# Altium schematic sheet SH3 - MCU.SchDoc
size B
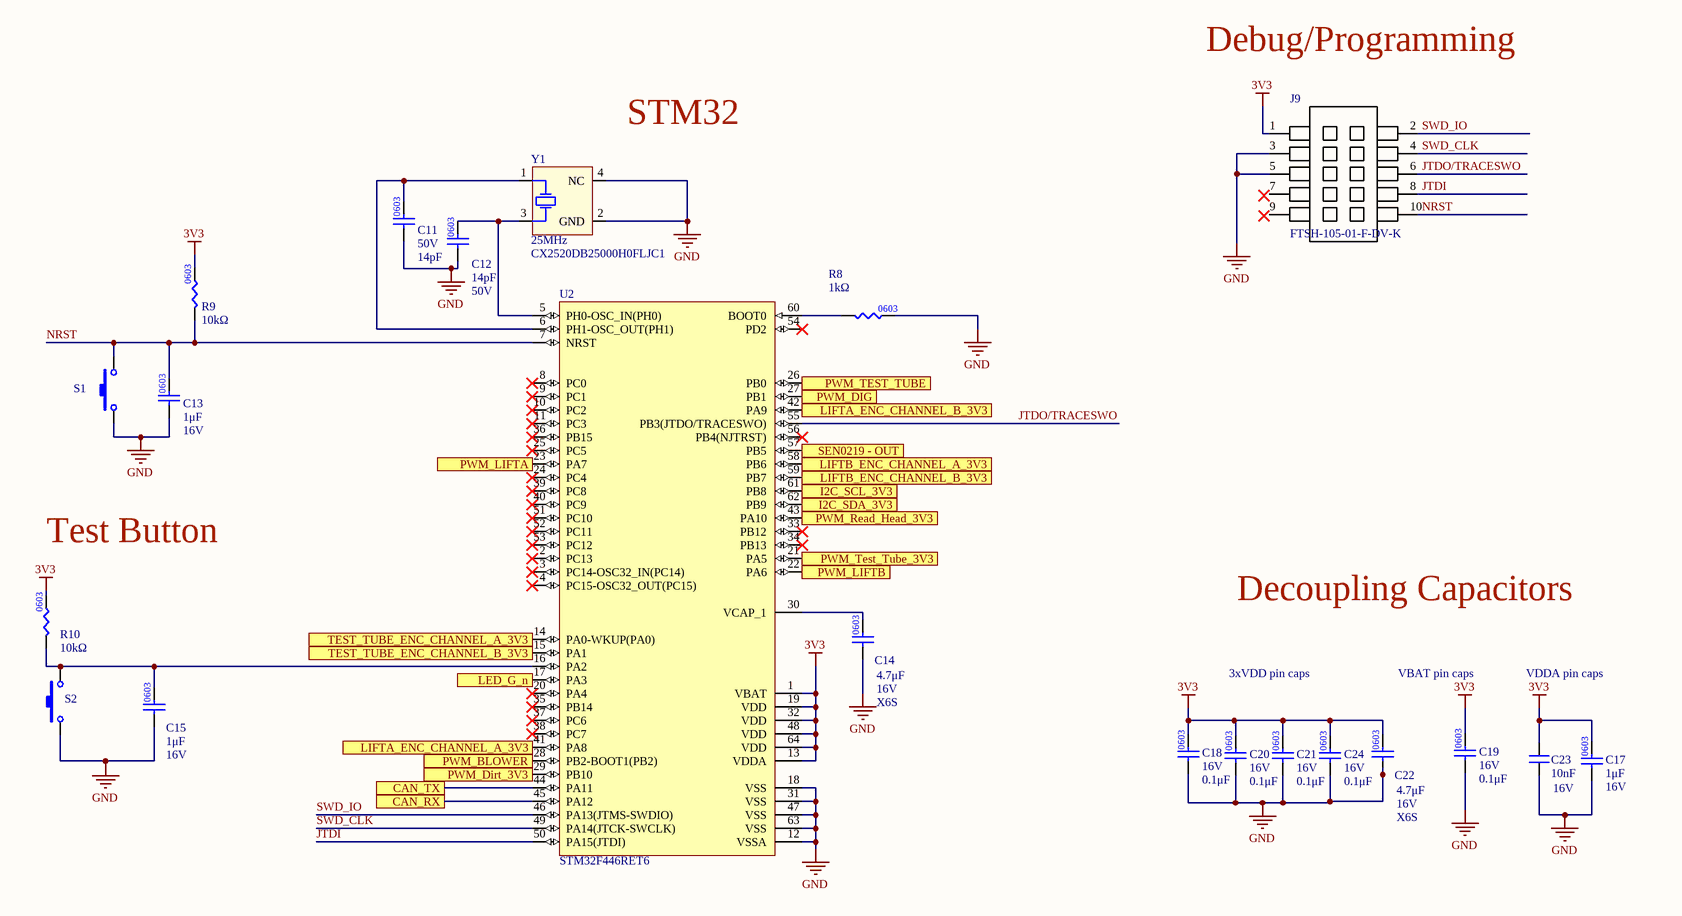
[diagram p0: SH3 - MCU.SchDoc]

## Parts
C11  value 14pF  Voltage Rating: 50V  [CAP0603]  (hidden comment: CAP_14pF_50V_0603)
C12  value 14pF  Voltage Rating: 50V  [CAP0603]  (hidden comment: CAP_14pF_50V_0603)
C13  value 1μF  Voltage Rating: 16V  [CAP0603]  (hidden comment: CAP_1uF_16V_0603)
C14  value 4.7μF  Dielectric: X6S  Voltage Rating: 16V  [CAP0603]  (hidden comment: CAP_4.7uF_16V_0603)
C15  value 1μF  Voltage Rating: 16V  [CAP0603]  (hidden comment: CAP_1uF_16V_0603)
C17  value 1μF  Voltage Rating: 16V  [CAP0603]  (hidden comment: CAP_1uF_16V_0603)
C18  value 0.1μF  Voltage Rating: 16V  [CAP0603]  (hidden comment: CAP_0.1uF_16V_0603)
C19  value 0.1μF  Voltage Rating: 16V  [CAP0603]  (hidden comment: CAP_0.1uF_16V_0603)
C20  value 0.1μF  Voltage Rating: 16V  [CAP0603]  (hidden comment: CAP_0.1uF_16V_0603)
C21  value 0.1μF  Voltage Rating: 16V  [CAP0603]  (hidden comment: CAP_0.1uF_16V_0603)
C22  value 4.7μF  Dielectric: X6S  Voltage Rating: 16V  [CAP0603]  (hidden comment: CAP_4.7uF_16V_0603)
C23  value 10nF  Voltage Rating: 16V  [CAP0603]  (hidden comment: CAP_10nF_0603)
C24  value 0.1μF  Voltage Rating: 16V  [CAP0603]  (hidden comment: CAP_0.1uF_16V_0603)
J9  Manufacturer Part Number 1: FTSH-105-01-F-DV-K  [FTSH-105-01-F-DV-K-P-TR]  (hidden comment: CON_PROGRAMMING)
R8  value 1kΩ  [RES0603]  (hidden comment: RES_1kΩ_0603_5%)
R9  value 10kΩ  [RES0603]  (hidden comment: RES_10kΩ_0603_5%)
R10  value 10kΩ  [RES0603]  (hidden comment: RES_10kΩ_0603_5%)
S1  SW_TACTILE  [B3U-1000P]  (value not drawn)
S2  SW_TACTILE  [B3U-1000P]  (value not drawn)
U2  STM32F446RET6  [STM-LQFP64_L]
Y1  Frequency: 25MHz  Manufacturer Part Number 1: CX2520DB25000H0FLJC1  [SOIC254P1016X440-4N]  (hidden comment: CRYSTAL_25MHZ)

## Ports
CAN_RX, CAN_TX, I2C_SCL_3V3, I2C_SDA_3V3, LED_G_n, LIFTA_ENC_CHANNEL_A_3V3, LIFTA_ENC_CHANNEL_B_3V3, LIFTB_ENC_CHANNEL_A_3V3, LIFTB_ENC_CHANNEL_B_3V3, PWM_BLOWER, PWM_DIG, PWM_Dirt_3V3, PWM_LIFTA, PWM_LIFTB, PWM_Read_Head_3V3, PWM_TEST_TUBE, PWM_Test_Tube_3V3, SEN0219 - OUT, TEST_TUBE_ENC_CHANNEL_A_3V3, TEST_TUBE_ENC_CHANNEL_B_3V3

## Nets
3V3: C17.2 C18.2 C19.2 C20.2 C21.2 C22.2 C23.2 C24.2 J9.1 R9.2 R10.2 U2.1(VBAT) U2.13(VDDA) U2.19(VDD) U2.32(VDD) U2.48(VDD) U2.64(VDD)
GND: C11.1 C12.1 C13.1 C14.1 C15.1 C17.1 C18.1 C19.1 C20.1 C21.1 C22.1 C23.1 C24.1 J9.3 J9.5 R8.2 S1.2 S2.1 U2.12(VSSA) U2.18(VSS) U2.31(VSS) U2.47(VSS) U2.63(VSS) Y1.2(GND) Y1.4(NC)
CAN_RX: U2.45(PA12) ; port CAN_RX
CAN_TX: U2.44(PA11) ; port CAN_TX
I2C_SCL_3V3: U2.61(PB8) ; port I2C_SCL_3V3
I2C_SDA_3V3: U2.62(PB9) ; port I2C_SDA_3V3
JTDI: J9.8 U2.50(PA15(JTDI))
JTDO/TRACESWO: J9.6 U2.55(PB3(JTDO/TRACESWO))
LED_G_n: U2.17(PA3) ; port LED_G_n
LIFTA_ENC_CHANNEL_A_3V3: U2.41(PA8) ; port LIFTA_ENC_CHANNEL_A_3V3
LIFTA_ENC_CHANNEL_B_3V3: U2.42(PA9) ; port LIFTA_ENC_CHANNEL_B_3V3
LIFTB_ENC_CHANNEL_A_3V3: U2.58(PB6) ; port LIFTB_ENC_CHANNEL_A_3V3
LIFTB_ENC_CHANNEL_B_3V3: U2.59(PB7) ; port LIFTB_ENC_CHANNEL_B_3V3
NRST: C13.2 J9.10 R9.1 S1.1 U2.7(NRST)
PWM_BLOWER: U2.28(PB2-BOOT1(PB2)) ; port PWM_BLOWER
PWM_DIG: U2.27(PB1) ; port PWM_DIG
PWM_Dirt_3V3: U2.29(PB10) ; port PWM_Dirt_3V3
PWM_LIFTA: U2.23(PA7) ; port PWM_LIFTA
PWM_LIFTB: U2.22(PA6) ; port PWM_LIFTB
PWM_Read_Head_3V3: U2.43(PA10) ; port PWM_Read_Head_3V3
PWM_TEST_TUBE: U2.26(PB0) ; port PWM_TEST_TUBE
PWM_Test_Tube_3V3: U2.21(PA5) ; port PWM_Test_Tube_3V3
SEN0219 - OUT: U2.57(PB5) ; port SEN0219 - OUT
SWD_CLK: J9.4 U2.49(PA14(JTCK-SWCLK))
SWD_IO: J9.2 U2.46(PA13(JTMS-SWDIO))
TEST_TUBE_ENC_CHANNEL_A_3V3: U2.14(PA0-WKUP(PA0)) ; port TEST_TUBE_ENC_CHANNEL_A_3V3
TEST_TUBE_ENC_CHANNEL_B_3V3: U2.15(PA1) ; port TEST_TUBE_ENC_CHANNEL_B_3V3
NetC11_2: C11.2 U2.6(PH1-OSC_OUT(PH1)) Y1.1(HOT)
NetC12_2: C12.2 U2.5(PH0-OSC_IN(PH0)) Y1.3(HOT)
NetC14_2: C14.2 U2.30(VCAP_1)
NetC15_2: C15.2 R10.1 S2.2 U2.16(PA2)
NetR8_1: R8.1 U2.60(BOOT0)

Not connected (* = marked no-connect by the designer): J9 7 9; U2 2(PC13)* 3(PC14-OSC32_IN(PC14))* 4(PC15-OSC32_OUT(PC15))* 8(PC0)* 9(PC1)* 10(PC2)* 11(PC3)* 20(PA4)* 24(PC4)* 25(PC5)* 33(PB12)* 34(PB13)* 35(PB14)* 36(PB15)* 37(PC6)* 38(PC7)* 39(PC8)* 40(PC9)* 51(PC10)* 52(PC11)* 53(PC12)* 54(PD2)* 56(PB4(NJTRST))*

## Notes on the sheet
- Debug/Programming
- STM32
- Test Button
- Decoupling Capacitors
- 3xVDD pin caps
- VBAT pin caps
- VDDA pin caps

## Library data of the parts
C11 C12 = CAP_14pF_50V_0603: CAP CER 14PF 50V C0G/NP0 0603; Manufacturer 1: Samsung; Manufacturer Part Number 1: CL10C140JB8NNNC; Dielectric: C0G; Supplier 1: Digi-Key; Supplier Part Number 1: 1276-2187-1-ND; Mounting Type: SMD; Package: 0603
C13 C15 C17 = CAP_1uF_16V_0603: CAP CER 1UF 16V Y5V 0603; Manufacturer 1: Yageo; Manufacturer Part Number 1: CC0603ZRY5V7BB105; Dielectric: Y5V; Supplier 1: Digi-Key; Supplier Part Number 1: 311-1372-1-ND; Package: 0603; Mounting Type: SMD
C14 C22 = CAP_4.7uF_16V_0603: CAP CER 4.7UF 16V X6S 0603; Manufacturer Part Number 1: GRM188C81C475KE11D; Manufacturer 1: Murata Electronics; Package: 0603; Supplier Part Number 1: 490-13362-1-ND; Supplier 1: Digi-Key; Mounting Type: SMD
C18-C21 C24 = CAP_0.1uF_16V_0603: CAP CER 0.1UF 16V X7R 0603; Manufacturer Part Number 1: CC0603KRX7R7BB104; Manufacturer 1: Yageo; Package: 0603; Supplier Part Number 1: 311-1088-1-ND; Supplier 1: Digi-Key; Dielectric: X7R
C23 = CAP_10nF_0603: CAP CER 10000PF 16V X7R 0603; Manufacturer Part Number 1: CC0603KRX7R7BB103; Manufacturer 1: Yageo; Package/Footprint: 0603; Supplier Part Number 1: 311-3369-1-ND; Supplier 1: Digi-Key; Dielectric: X7R; Mounting Type: SMD
J9 = CON_PROGRAMMING: CONN HEADER SMD 10POS 1.27MM; Manufacturer 1: Samtec; Supplier 1: Digi-Key; Pitch: 1.27mm; Supplier Part Number 1: SAM8796-ND; Mounting Type: SMD
R8 = RES_1kΩ_0603_5%: RES 1K OHM 5% 1/10W 0603; Manufacturer 1: Yageo; Manufacturer Part Number 1: RC0603JR-071KL; Supplier Part Number 1: 311-1.0KGRCT-ND; Supplier 1: Digi-Key; Mounting Type: SMD; Package: 0603
R9 R10 = RES_10kΩ_0603_5%: RES 10K OHM 5% 1/10W 0603; Manufacturer 1: Yageo; Manufacturer Part Number 1: RC0603JR-0710KL; Supplier 1: Digi-Key; Supplier Part Number 1: 311-10KGRCT-ND; Package: 0603; Mounting Type: SMD
S1 S2 = SW_TACTILE: SWITCH TACTILE SPST-NO 0.05A 12V; Manufacturer 1: Omron Electronics Inc-EMC Div; Package/Footprint: SMD; Manufacturer Part Number 1: B3U-1000P; Supplier 1: Digi-Key; Supplier Part Number 1: SW1020CT-ND; Mounting Type: SMD
U2 = MCU_STM32F446RET6: ARM Cortex-M4 32-bit MCU+FPU, 512 KB Flash, 128 KB Internal RAM, 50 I/Os, 64-Pin LQFP, -40 to 85 degC, Tray; I/Os (High Current): 50; Supply Voltage(Vcc) min (V): 1.7; Operating Frequency(F) (Processor speed) (MHz): 180; D/A Converter: 2; Internal RAM Size (kB): 128; FLASH Size (Prog) (kB): 512; Core: ARM Cortex-M4; ComponentLink1Description: Manufacturer URL; Package Reference: 64-Pin Low-profile Quad Flat Package, Body 10 x 10 mm, Pitch 0.5 mm; ComponentLink2URL: http://www.st.com/st-web-ui/static/active/en/resource/technical/document/datasheet/DM00141306.pdf; Packing: Tray; DatasheetVersion: Rev. 6; ComponentLink1URL: http://www.st.com/; ComponentLink2Description: Datasheet; Package Description: LQFP64; Mounting Technology: Surface Mount; Supplier 1: Digi-Key; Supplier Part Number 1: 497-15376-ND
Y1 = CRYSTAL_25MHZ: CRYSTAL 25.0000MHZ 12PF SMD; Manufacturer 1: Kyocera AVX; Load Capacitance: 12pF; Supplier 1: Digi-Key; Supplier Part Number 1: 1253-1724-1-ND; Mounting Type: SMD; Package/Footprint: SMD